# Altium project QUTMS_Shutdownboard_V2.PrjPcb (part 2 of 2)

## Sheet Power.SchDoc: QUTMS Shutdown V2 - Power
size A4; Author: Jonn Dillon; Organization: QUT Motorsport; Address1: O-120; Address2: O Block; Address3: QUT Gardens Point; Address4: Brisbane, 4000; DocumentNumber: 13; SheetNumber: 13; SheetTotal: 13
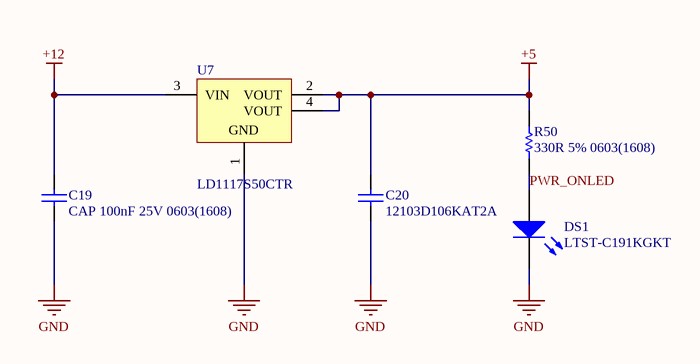
[diagram p11: Power.SchDoc]

### Parts
C19  CAP 100nF 25V 0603(1608)  [CAPC0603(1608)100_N]
C20  12103D106KAT2A  [CAPC3225X279X50LL20T25]
DS1  LTST-C191KGKT  [LITE-ON-LTST-C191KRKT-2_V]
R50  330R 5% 0603(1608)  [RESC0603(1608)_L]
U7  LD1117S50CTR  [SOT-223_N]

### Nets
+5: C20.2 R50.1 U7.2(VOUT) U7.4(VOUT)
+12: C19.2 U7.3(VIN)
GND: C19.1 C20.1 DS1.2(K) U7.1(GND)
PWR_ONLED: DS1.1(A) R50.2

### Notes on the sheet
- Title
- Size:
- Date:
- A4
- Number:
- Time:
- Revision:
- Sheet
- of
- File:

### Library data of the parts
C19 = CMP-1035-02587-1: CAP 100nF 25V ±5% 0603 (1608 Metric) Thickness 1mm SMD; Case-EIA: 0603; Tolerance: Â±5%; Case-Metric: 1608; Technology: SMT; Max Thickness: 1 mm; Rated Voltage: 25 V; Value: 100nF
C20 = CMP-2000-05477-1: Chip Capacitor, 10 uF, +/- 10%, 25 V, -55 to 85 degC, 1210 (3225 Metric), RoHS, Tape and Reel; Manufacturer: AVX; Product Training Modules: ComponentSolutionsforSmartMeterApplications; Capacitance: 10µF; Catalog Drawings: AT2A_1210_2.79; Voltage - Rated: 25V; Other Names: 478-1627-6; Online Catalog: X5RDielectric(D); Temperature Coefficient: X5R; Package Reference: 1210; Lead Style: -; Manufacturer URL: http://www.avx.com/; Datasheet Version: 05/2016; Ratings: -; Mounting Technology: SurfaceMount; Datasheet URL: http://datasheets.avx.com/cx5r.pdf; Package Description: 2-Pin Surface Mount Device, Body 3.2 x 2.5 mm; Applications: GeneralPurpose; Features: -; Tolerance: ±10%; Package / Case: 1210(3225Metric); Lead Spacing: -; Series: -; Mounting Type: SurfaceMount,MLCC; Family: CeramicCapacitors; Standard Package: 1; Category: Capacitors; Packaging: Digi-Reel®; Thickness (Max): 0.110"(2.79mm); Operating Temperature: -55°C~85°C; Size / Dimension: 0.126"Lx0.098"W(3.20mmx2.50mm); Height - Seated (Max): -
DS1 = CMP-2000-05198-1: Chip LED, Green, 574 nm, 40 pF, -55 to 85 degC, 2-Pin SMD, RoHS, Tape and Reel; Manufacturer: Lite-On; Rad Hardened: No; Emitting Color: YellowGreen; Product Height (mm): 0.55mm; Forward Voltage: 2.4V; Number of Elements: 1; Dominant Wave Length: 571nm; DELETED: Compliant; Viewing Angle: 130deg; High Brightness: Yes; Peak Wavelength: 574nm; Type: Uni-Color; Forward Current: 30mA; Product Length (mm): 1.6mm; Luminous Intensity: 35mcd; Test Current (It): 20mA; Chip Material: AlGaInP; Product Depth (mm): 0.8mm; Shape Type: Rectangular; Reverse Voltage: 5V; Power Dissipation: 75W; Pin Count: 2; Lens Dimensions: 1.1X0.8X0.37mm; Packaging: TapeandReel; Main Category: ChipLED; Operating Temperature Classification: Industrial; Package Type: ChipLed; Mounting: SurfaceMount; Lum Intensity: 35mcd; Operating Temp Range: -55Cto85C; Datasheet Version: Jan-07; Datasheet URL: http://download.siliconexpert.com/pdfs/2007/08/26/semi_b/manual/lot/ds/ltst-c191kgkt.pdf; Manufacturer URL: http://www.us.liteon.com/
R50 = CMP-1012-00062-1: 330R 0.1W 5% 0603 (1608 Metric)  SMD; Value: 330.00 Ohm; Case-EIA: 0603; Case-Metric: 1608; Tolerance: 5 %; Power: 0.1 W; Technology: SMT
U7 = CMP-0244-00311-1: Fixed Low Drop Positive Voltage Regulator, 5V, 4-Pin SOT-223, Tape and Reel; PackageReference: SOT-223; PackageVersion: 2010; ComponentLink2URL: http://www.st.com/internet/com/TECHNICAL_RESOURCES/TECHNICAL_LITERATURE/DATASHEET/CD00000544.pdf; ComponentLink1URL: http://www.st.com; ComponentLink2Description: Datasheet; DatasheetVersion: 1/11/2011; ComponentLink1Description: Manufacturer URL; PackageDescription: 4-Pin SOT-223 Package, 6.5 x 3.5 mm Body, 2.3 mm Pitch, 7 mm Lead Span

## Sheet Demux.SchDoc: QUTMS Shutdown V2 - Demux
size A4; Organization: QUT Motorsport; Address1: O-120; Address2: O Block; Address3: QUT Gardnes Point; Address4: Brisbane, 4000; DocumentNumber: 4; SheetNumber: 4; SheetTotal: 13
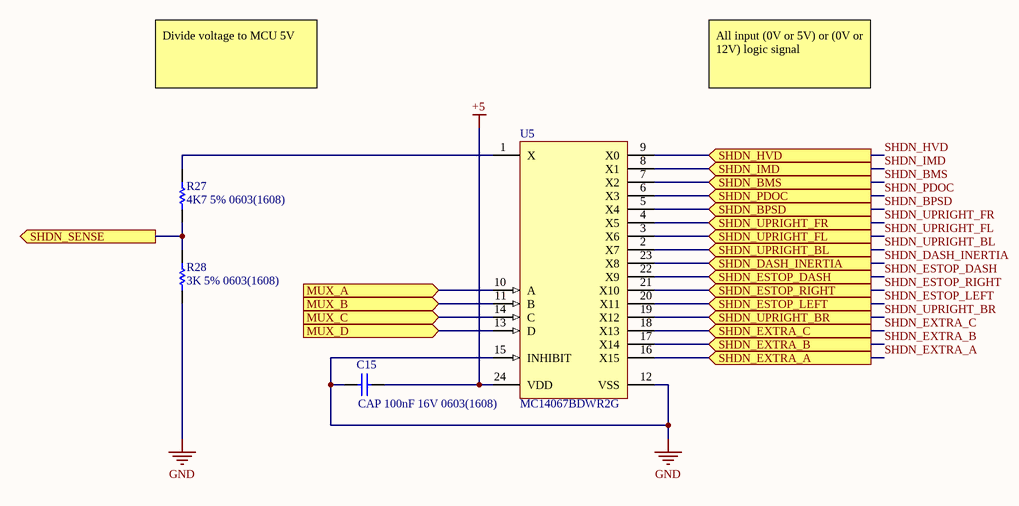
[diagram p12: Demux.SchDoc]

### Parts
C15  CAP 100nF 16V 0603(1608)  [CAPC0603(1608)100_M]
R27  4K7 5% 0603(1608)  [RESC0603(1608)_N]
R28  3K 5% 0603(1608)  [RESC0603(1608)_M]
U5  MC14067BDWR2G  [ONSC-SOIC-24-751E-04_V]

### Ports
MUX_A (in), MUX_B (in), MUX_C (in), MUX_D (in), SHDN_BMS (in), SHDN_BPSD (in), SHDN_DASH_INERTIA (in), SHDN_ESTOP_DASH (in), SHDN_ESTOP_LEFT (in), SHDN_ESTOP_RIGHT (in), SHDN_EXTRA_A (in), SHDN_EXTRA_B (in), SHDN_EXTRA_C (in), SHDN_HVD (in), SHDN_IMD (in), SHDN_PDOC (in), SHDN_SENSE (out), SHDN_UPRIGHT_BL (in), SHDN_UPRIGHT_BR (in), SHDN_UPRIGHT_FL (in), SHDN_UPRIGHT_FR (in)

### Nets
+5: C15.2 U5.24(VDD)
GND: C15.1 R28.1 U5.12(VSS) U5.15(INHIBIT)
SHDN_BMS: U5.7(X2) ; port SHDN_BMS
SHDN_BPSD: U5.5(X4) ; port SHDN_BPSD
SHDN_DASH_INERTIA: U5.23(X8) ; port SHDN_DASH_INERTIA
SHDN_ESTOP_DASH: U5.22(X9) ; port SHDN_ESTOP_DASH
SHDN_ESTOP_LEFT: U5.20(X11) ; port SHDN_ESTOP_LEFT
SHDN_ESTOP_RIGHT: U5.21(X10) ; port SHDN_ESTOP_RIGHT
SHDN_EXTRA_A: U5.16(X15) ; port SHDN_EXTRA_A
SHDN_EXTRA_B: U5.17(X14) ; port SHDN_EXTRA_B
SHDN_EXTRA_C: U5.18(X13) ; port SHDN_EXTRA_C
SHDN_HVD: U5.9(X0) ; port SHDN_HVD
SHDN_IMD: U5.8(X1) ; port SHDN_IMD
SHDN_PDOC: U5.6(X3) ; port SHDN_PDOC
SHDN_UPRIGHT_BL: U5.2(X7) ; port SHDN_UPRIGHT_BL
SHDN_UPRIGHT_BR: U5.19(X12) ; port SHDN_UPRIGHT_BR
SHDN_UPRIGHT_FL: U5.3(X6) ; port SHDN_UPRIGHT_FL
SHDN_UPRIGHT_FR: U5.4(X5) ; port SHDN_UPRIGHT_FR
NetR27_1: R27.1 R28.2 ; port SHDN_SENSE
NetR27_2: R27.2 U5.1(X)
NetU5_10: U5.10(A) ; port MUX_A
NetU5_11: U5.11(B) ; port MUX_B
NetU5_13: U5.13(D) ; port MUX_D
NetU5_14: U5.14(C) ; port MUX_C

### Notes on the sheet
- Divide voltage to MCU 5V
- All input (0V or 5V) or (0V or 12V) logic signal
- Title
- Size:
- Date:
- A4
- Number:
- Time:
- Revision:
- Sheet
- of
- File:

### Library data of the parts
C15 = CMP-1035-02583-1: CAP 100nF 16V ±5% 0603 (1608 Metric) Thickness 1mm SMD; Tolerance: Â±5%; Case-Metric: 1608; Case-EIA: 0603; Rated Voltage: 16 V; Max Thickness: 1 mm; Technology: SMT; Value: 100nF
R27 = CMP-1012-00090-1: 4K7 0.1W 5% 0603 (1608 Metric)  SMD; Case-Metric: 1608; Value: 4700.00 Ohm; Case-EIA: 0603; Tolerance: 5 %; Technology: SMT; Power: 0.1 W
R28 = CMP-1012-00085-1: 3K 0.1W 5% 0603 (1608 Metric)  SMD; Case-EIA: 0603; Case-Metric: 1608; Value: 3000.00 Ohm; Power: 0.1 W; Tolerance: 5 %; Technology: SMT
U5 = CMP-1307-00132-1: Analog Multiplexer / Demultiplexer, 3 to 18 V, -55 to 125 degC, 24-Pin SOIC, Pb-Free, Tape and Reel; Manufacturer: On Semiconductor; VCC Min (V): 3; Icc Max (uA): 600; VCC Max (V): 18; PackageReference: SOIC-24-751E-04; DatasheetVersion: Rev. 8; ComponentLink2URL: http://www.onsemi.com/pub_link/Collateral/MC14067B-D.PDF; ComponentLink3URL: http://www.onsemi.com/pub_link/Collateral/751E-04.PDF; Mounting Technology: Surface Mount; PackageDescription: 24-Pin Small Outline Integrated Circuit, Body 15.4 x 7.5 mm, Pitch 1.27 mm; ComponentLink3Description: Package Specification; ComponentLink1URL: http://www.onsemi.com/; ComponentLink2Description: Datasheet; RoHS: TRUE; Packing: Tape and Reel; ComponentLink1Description: Manufacturer URL; PartNumber: MC14067BDWR2G; PackageVersion: Rev. F, 07/2012

## Nets that join several sheets
+5: BSPD_System (10 pins), BSPD_Simulation (R6.2 R7.2 R10.2), ShutdownLoop (6 pins), MCU (6 pins), CAN (6 pins), Power (C20.2 R50.1 U7.2 U7.4), Demux (C15.2 U5.24)
+12: HVD_Filtering (Q3.3 R29.2), IMD_Filtering (Q5.3 R34.2), BMS_FIltering (Q1.3 R1.2), PDOC_Filtering (Q9.3 R45.2), Connector (J1.26 J1.27 J1.28 J1.29), MCU (Q7.3 R39.2), Power (C19.2 U7.3)
GND: HVD_Filtering (Q4.2 R31.1 R33.1), IMD_Filtering (Q6.2 R36.1 R38.1), BMS_FIltering (Q2.2 R3.1 R5.1), PDOC_Filtering (Q10.2 R47.1 R49.1), BSPD_System (12 pins), BSPD_Simulation (R8.1 R9.1 R11.1), Connector (J1.31 J1.32 J1.33 J1.34), ShutdownLoop (16 pins), MCU (14 pins), CAN (8 pins), Power (C19.1 C20.1 DS1.2 U7.1), Demux (C15.1 R28.1 U5.12 U5.15)
BMS_IN: BMS_FIltering (R4.1 R5.2), Connector (J1.6)
BRK_PRS_IN_RAW: BSPD_Simulation (P1.3), Connector (J1.4)
CAN_N: Connector (J1.17), CAN (R24.2 U4.6)
CAN_P: Connector (J1.16), CAN (R23.2 U4.7)
HVD_IN: HVD_Filtering (R32.1 R33.2), Connector (J1.9)
IMD_IN: IMD_Filtering (R37.1 R38.2), Connector (J1.7)
LEM_IN_RAW: BSPD_Simulation (P2.3), Connector (J1.3)
NetC1_2: BSPD_System (C1.2 U1.7), BSPD_Simulation (P1.2)
NetC3_2: BSPD_System (C3.2 U1.5), BSPD_Simulation (P2.2)
NetK1_21: HVD_Filtering (Q3.2 R31.2), ShutdownLoop (K1.21 U10.4 U10.6)
NetK2_21: IMD_Filtering (Q5.2 R36.2), ShutdownLoop (K2.21 U11.4 U11.6)
NetK3_21: BMS_FIltering (Q1.2 R3.2), ShutdownLoop (K3.21 U12.4 U12.6)
NetK4_21: PDOC_Filtering (Q9.2 R47.2), ShutdownLoop (K4.21 U13.4 U13.6)
NetK5_21: BSPD_System (R15.1 U1.14), ShutdownLoop (K5.21 U14.4 U14.6)
NetK6_21: ShutdownLoop (K6.21 U15.4 U15.6), MCU (Q7.2 R41.2)
NetR27_1: MCU (U6.37), Demux (R27.1 R28.2)
NetU5_10: MCU (U6.35), Demux (U5.10)
NetU5_11: MCU (U6.34), Demux (U5.11)
NetU5_13: MCU (U6.32), Demux (U5.13)
NetU5_14: MCU (U6.33), Demux (U5.14)
PDOC_IN: PDOC_Filtering (R48.1 R49.2), Connector (J1.5)
SHDN_BMS: ShutdownLoop (K3.24 K3.A U12.5), Demux (U5.7)
SHDN_BPSD: ShutdownLoop (K5.24 K5.A U14.5), Demux (U5.5)
SHDN_DASH_INERTIA: Connector (J1.25), Demux (U5.23)
SHDN_ESTOP_DASH: Connector (J1.24), Demux (U5.22)
SHDN_ESTOP_LEFT: Connector (J1.22), Demux (U5.20)
SHDN_ESTOP_RIGHT: Connector (J1.23), Demux (U5.21)
SHDN_EXTRA_A: Connector (J1.10), Demux (U5.16)
SHDN_EXTRA_B: Connector (J1.11), Demux (U5.17)
SHDN_EXTRA_C: Connector (J1.12), Demux (U5.18)
SHDN_HVD: ShutdownLoop (K1.24 K1.A U10.5), Demux (U5.9)
SHDN_IMD: ShutdownLoop (K2.24 K2.A U11.5), Demux (U5.8)
SHDN_PDOC: ShutdownLoop (K4.24 K4.A U13.5), Demux (U5.6)
SHDN_UPRIGHT_BL: Connector (J1.20), Demux (U5.2)
SHDN_UPRIGHT_BR: Connector (J1.21), Demux (U5.19)
SHDN_UPRIGHT_FL: Connector (J1.18), Demux (U5.3)
SHDN_UPRIGHT_FR: Connector (J1.19), Demux (U5.4)
SHUTDOWN_IN: Connector (J1.8), ShutdownLoop (K1.11 P5.1)
SHUTDOWN_OUT: Connector (J1.2), ShutdownLoop (K5.14 P9.2)
SHUTDOWN_RESET: Connector (J1.1), ShutdownLoop (R53.1 R54.2)